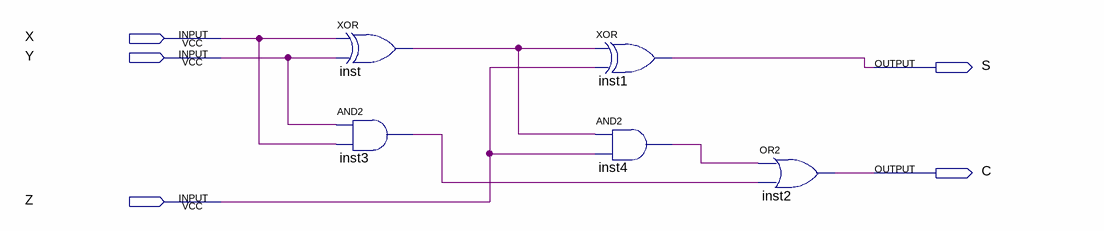
[diagram p0: schematic sheet]
// Quartus schematic full_adder_logic.bdf as structural Verilog: 5 symbols, 5 pins
module full_adder_logic (
  input  X,
  input  Y,
  input  Z,
  output S,
  output C
);

  wire inst3_out, inst4_out, inst_out;

  xor inst (inst_out, X, Y);
  and inst3 (inst3_out, Y, X);
  xor inst1 (S, inst_out, Z);
  and inst4 (inst4_out, inst_out, Z);
  or inst2 (C, inst4_out, inst3_out);
endmodule
